# EAGLE schematic untitled (EAGLE 9.2.0)
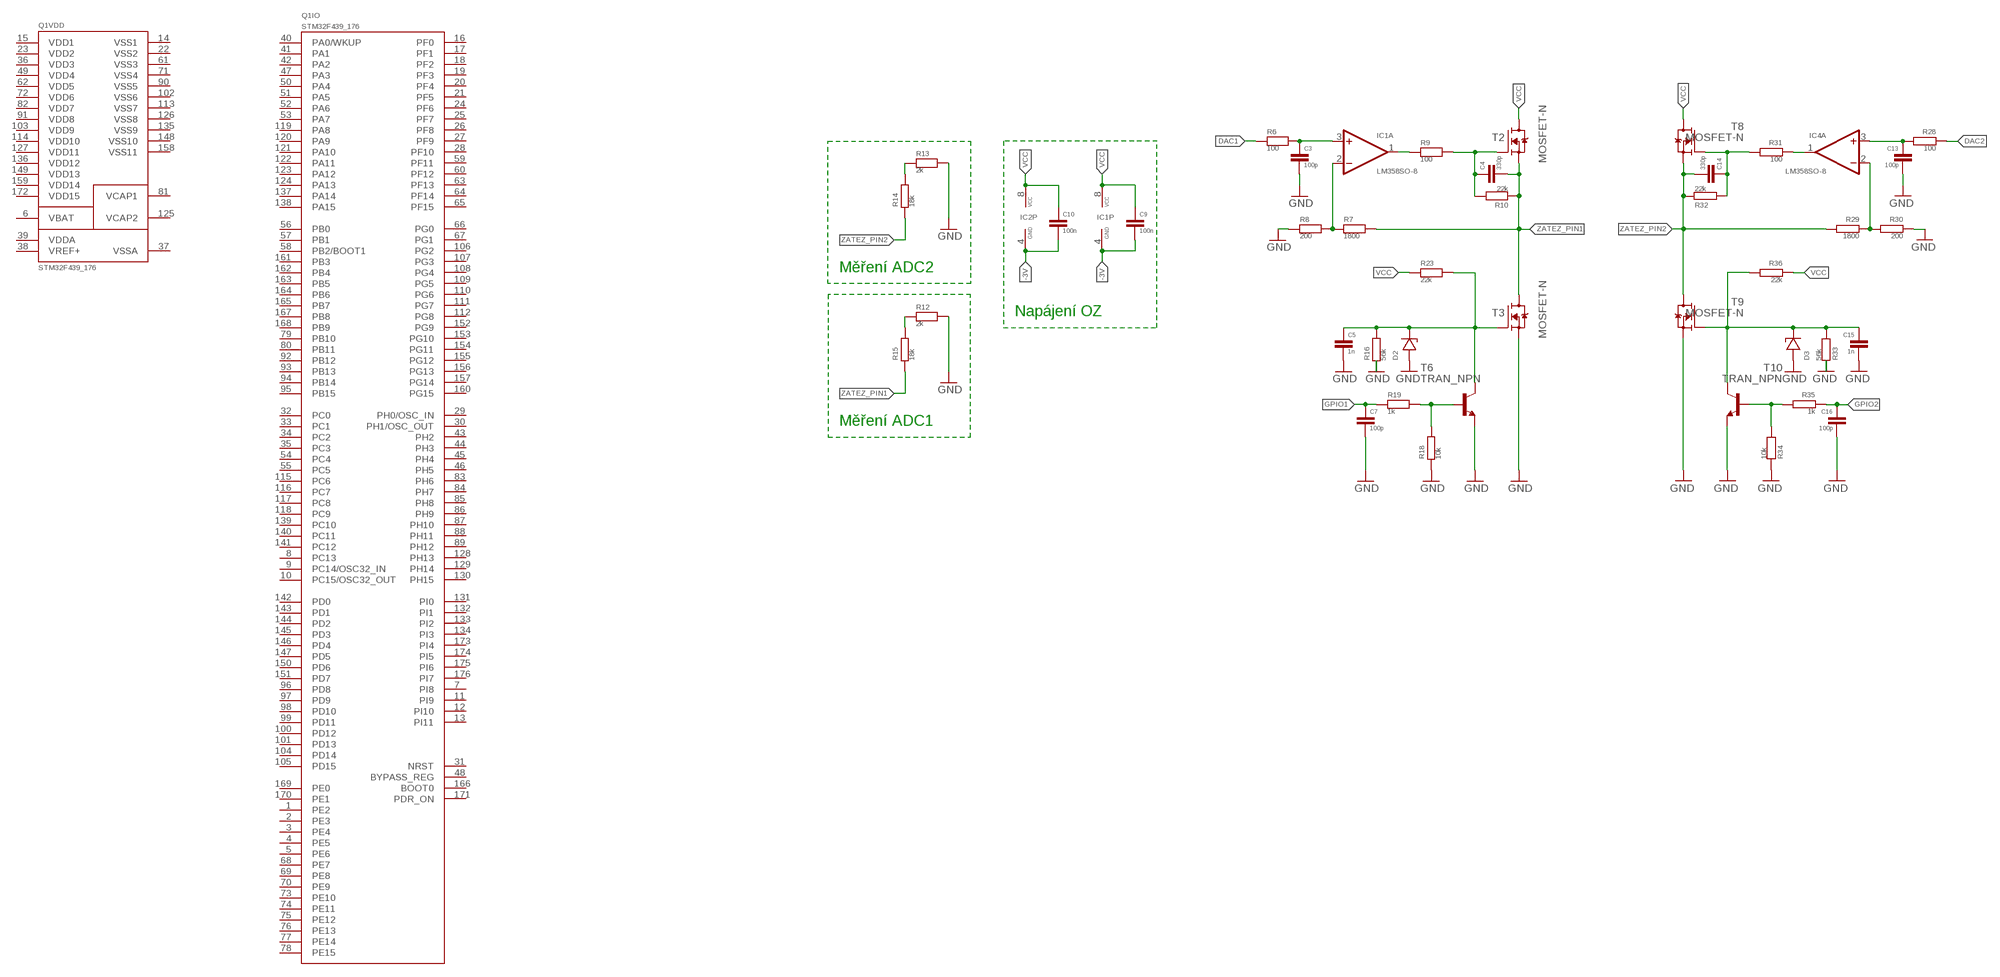
[diagram p0: schematic, sheet 1]

## Parts
C3  100p  C0603  [0603]
C4  330p  C0603  [0603]
C5  1n  C0603  [0603]
C7  100p  C0603  [0603]
C9  100n  C0603  [0603]
C10  100n  C0603  [0603]
C13  100p  C0603  [0603]
C14  330p  C0603  [0603]
C15  1n  C0603  [0603]
C16  100p  C0603  [0603]
D2  D_ZENERSMA  [SMA]
D3  D_ZENERSMA  [SMA]
IC1  LM358SO-8  [SO-8]
IC2  LM358SO-8  [SO-8]
IC4  LM358SO-8  [SO-8]
Q1  STM32F439_176  [TQFP176]
R6  100  R0603  [0603]
R7  1800  R0603  [0603]
R8  200  R0603  [0603]
R9  100  R0603  [0603]
R10  22k  R0603  [0603]
R12  2k  R0603  [0603]
R13  2k  R0603  [0603]
R14  18k  R0603  [0603]
R15  18k  R0603  [0603]
R16  56k  R0603  [0603]
R18  10k  R0603  [0603]
R19  1k  R0603  [0603]
R23  22k  R0603  [0603]
R28  100  R0603  [0603]
R29  1800  R0603  [0603]
R30  200  R0603  [0603]
R31  100  R0603  [0603]
R32  22k  R0603  [0603]
R33  56k  R0603  [0603]
R34  10k  R0603  [0603]
R35  1k  R0603  [0603]
R36  22k  R0603  [0603]
T2  MOSFET-N  MOSFET-NTO220DL  [TO220DL]
T3  MOSFET-N  MOSFET-NTO220DL  [TO220DL]
T6  TRAN_NPN  [SOT23-3]
T8  MOSFET-N  MOSFET-NTO220DL  [TO220DL]
T9  MOSFET-N  MOSFET-NTO220DL  [TO220DL]
T10  TRAN_NPN  [SOT23-3]

## Nets
-3V: C9.2 C10.2 IC1.4(P:GND) IC2.4(P:GND)
DAC1: R6.1
DAC2: R28.1
GND: C3.2 C5.2 C7.2 C13.2 C15.2 C16.2 D2.A D3.A R8.1 R12.2 R13.2 R16.1 R18.1 R30.1 R33.1 R34.1 T3.3(S) T6.2(E) T9.3(S) T10.2(E)
GPIO1: C7.1 R19.1
GPIO2: C16.1 R35.1
N$3: C3.1 IC1.3(A:+IN) R6.2
N$8: IC1.1(A:OUT) R9.1
N$9: C4.1 R9.2 R10.2 T2.1(G)
N$10: C13.1 IC4.3(A:+IN) R28.2
N$11: IC4.1(A:OUT) R31.1
N$12: R12.1 R15.2
N$13: R13.1 R14.2
N$14: IC1.2(A:-IN) R7.1 R8.2
N$16: C5.1 D2.C(K) R16.2 R23.2 T3.1(G) T6.3(C)
N$18: R18.2 R19.2 T6.1(B)
N$22: C15.1 D3.C(K) R33.2 R36.2 T9.1(G) T10.3(C)
N$23: R34.2 R35.2 T10.1(B)
N$24: C14.1 R31.2 R32.2 T8.1(G)
N$25: IC4.2(A:-IN) R29.1 R30.2
VCC: C9.1 C10.1 IC1.8(P:VCC) IC2.8(P:VCC) R23.1 R36.1 T2.2(D) T8.2(D)
ZATEZ_PIN1: C4.2 R7.2 R10.1 R15.1 T2.3(S) T3.2(D)
ZATEZ_PIN2: C14.2 R14.1 R29.2 R32.1 T8.3(S) T9.2(D)
Unconnected: IC1.5(B:+IN) IC1.6(B:-IN) IC1.7(B:OUT) IC2.1(A:OUT) IC2.2(A:-IN) IC2.3(A:+IN) IC2.5(B:+IN) IC2.6(B:-IN) IC2.7(B:OUT) IC4.5(B:+IN) IC4.6(B:-IN) IC4.7(B:OUT) Q1.1(IO:PE2) Q1.2(IO:PE3) Q1.3(IO:PE4) Q1.4(IO:PE5) Q1.5(IO:PE6) Q1.7(IO:PI8) Q1.8(IO:PC13) Q1.9(IO:PC14/OSC32_IN) Q1.10(IO:PC15/OSC32_OUT) Q1.11(IO:PI9) Q1.12(IO:PI10) Q1.13(IO:PI11) Q1.16(IO:PF0) Q1.17(IO:PF1) Q1.18(IO:PF2) Q1.19(IO:PF3) Q1.20(IO:PF4) Q1.21(IO:PF5) Q1.24(IO:PF6) Q1.25(IO:PF7) Q1.26(IO:PF8) Q1.27(IO:PF9) Q1.28(IO:PF10) Q1.29(IO:PH0/OSC_IN) Q1.30(IO:PH1/OSC_OUT) Q1.31(IO:NRST) Q1.32(IO:PC0) Q1.33(IO:PC1) Q1.34(IO:PC2) Q1.35(IO:PC3) Q1.38(VDD:VREF+) Q1.40(IO:PA0/WKUP) Q1.41(IO:PA1) Q1.42(IO:PA2) Q1.43(IO:PH2) Q1.44(IO:PH3) Q1.45(IO:PH4) Q1.46(IO:PH5) Q1.47(IO:PA3) Q1.48(IO:BYPASS_REG) Q1.50(IO:PA4) Q1.51(IO:PA5) Q1.52(IO:PA6) Q1.53(IO:PA7) Q1.54(IO:PC4) Q1.55(IO:PC5) Q1.56(IO:PB0) Q1.57(IO:PB1) Q1.58(IO:PB2/BOOT1) Q1.59(IO:PF11) Q1.60(IO:PF12) Q1.63(IO:PF13) Q1.64(IO:PF14) Q1.65(IO:PF15) Q1.66(IO:PG0) Q1.67(IO:PG1) Q1.68(IO:PE7) Q1.69(IO:PE8) Q1.70(IO:PE9) Q1.73(IO:PE10) Q1.74(IO:PE11) Q1.75(IO:PE12) Q1.76(IO:PE13) Q1.77(IO:PE14) Q1.78(IO:PE15) Q1.79(IO:PB10) Q1.80(IO:PB11) Q1.81(VDD:VCAP1) Q1.83(IO:PH6) Q1.84(IO:PH7) Q1.85(IO:PH8) Q1.86(IO:PH9) Q1.87(IO:PH10) Q1.88(IO:PH11) Q1.89(IO:PH12) Q1.92(IO:PB12) Q1.93(IO:PB13) Q1.94(IO:PB14) Q1.95(IO:PB15) Q1.96(IO:PD8) Q1.97(IO:PD9) Q1.98(IO:PD10) Q1.99(IO:PD11) Q1.100(IO:PD12) Q1.101(IO:PD13) Q1.104(IO:PD14) Q1.105(IO:PD15) Q1.106(IO:PG2) Q1.107(IO:PG3) Q1.108(IO:PG4) Q1.109(IO:PG5) Q1.110(IO:PG6) Q1.111(IO:PG7) Q1.112(IO:PG8) Q1.115(IO:PC6) Q1.116(IO:PC7) Q1.117(IO:PC8) Q1.118(IO:PC9) Q1.119(IO:PA8) Q1.120(IO:PA9) Q1.121(IO:PA10) Q1.122(IO:PA11) Q1.123(IO:PA12) Q1.124(IO:PA13) Q1.125(VDD:VCAP2) Q1.128(IO:PH13) Q1.129(IO:PH14) Q1.130(IO:PH15) Q1.131(IO:PI0) Q1.132(IO:PI1) Q1.133(IO:PI2) Q1.134(IO:PI3) Q1.137(IO:PA14) Q1.138(IO:PA15) Q1.139(IO:PC10) Q1.140(IO:PC11) Q1.141(IO:PC12) Q1.142(IO:PD0) Q1.143(IO:PD1) Q1.144(IO:PD2) Q1.145(IO:PD3) Q1.146(IO:PD4) Q1.147(IO:PD5) Q1.150(IO:PD6) Q1.151(IO:PD7) Q1.152(IO:PG9) Q1.153(IO:PG10) Q1.154(IO:PG11) Q1.155(IO:PG12) Q1.156(IO:PG13) Q1.157(IO:PG14) Q1.160(IO:PG15) Q1.161(IO:PB3) Q1.162(IO:PB4) Q1.163(IO:PB5) Q1.164(IO:PB6) Q1.165(IO:PB7) Q1.166(IO:BOOT0) Q1.167(IO:PB8) Q1.168(IO:PB9) Q1.169(IO:PE0) Q1.170(IO:PE1) Q1.171(IO:PDR_ON) Q1.173(IO:PI4) Q1.174(IO:PI5) Q1.175(IO:PI6) Q1.176(IO:PI7)

## Notes on the sheet
- Měření ADC2
- Napájení OZ
- Měření ADC1

## Power pins joined to a net without a drawn wire
GND: IC4.4(P:GND)
VBAT: Q1.6(VDD:VBAT)
VCC: IC4.8(P:VCC)
VDD1: Q1.15(VDD:VDD1)
VDD2: Q1.23(VDD:VDD2)
VDD3: Q1.36(VDD:VDD3)
VDD4: Q1.49(VDD:VDD4)
VDD5: Q1.62(VDD:VDD5)
VDD6: Q1.72(VDD:VDD6)
VDD7: Q1.82(VDD:VDD7)
VDD8: Q1.91(VDD:VDD8)
VDD9: Q1.103(VDD:VDD9)
VDD10: Q1.114(VDD:VDD10)
VDD11: Q1.127(VDD:VDD11)
VDD12: Q1.136(VDD:VDD12)
VDD13: Q1.149(VDD:VDD13)
VDD14: Q1.159(VDD:VDD14)
VDD15: Q1.172(VDD:VDD15)
VDDA: Q1.39(VDD:VDDA)
VSS1: Q1.14(VDD:VSS1)
VSS2: Q1.22(VDD:VSS2)
VSS3: Q1.61(VDD:VSS3)
VSS4: Q1.71(VDD:VSS4)
VSS5: Q1.90(VDD:VSS5)
VSS6: Q1.102(VDD:VSS6)
VSS7: Q1.113(VDD:VSS7)
VSS8: Q1.126(VDD:VSS8)
VSS9: Q1.135(VDD:VSS9)
VSS10: Q1.148(VDD:VSS10)
VSS11: Q1.158(VDD:VSS11)
VSSA: Q1.37(VDD:VSSA)

## Library data of the parts
C3-C5 C7 C9 C10 C13-C16 = ogr_lib:C: SMD/THD Ceramic or Foil Capacitor; DESCRIPTION: Capacitor Ceramic multilayer 50V X7R/X5R 10%; OC: Open Source; PRICE100: 0.2
D2 D3 = ogr_lib:D_ZENER: Zener Diode
IC1 IC2 IC4 = ogr_lib:LM358: IC, OP AMP
Q1 = ogr_lib:STM32F439_176: STMICROELECTRONICS STM32F439IIT6 MCU, 32BIT, CORTEX-M4, 180MHZ, LQFP-176; DESCRIPTION: STMICROELECTRONICS STM32F439IIT6 MCU, 32BIT, CORTEX-M4, 180MHZ, LQFP-176; OC: S:182443; PRICE100: 289
R6-R10 R12-R16 R18 R19 R23 R28-R36 = ogr_lib:R: Resistor; DESCRIPTION: SMD Chip Resistor Standart 1% 0.1W; OC: Open Source; PRICE100: 0.1
T2 T3 T8 T9 = ogr_lib:MOSFET-N: N-CHANNEL MOSFET GENERAL
T6 T10 = ogr_lib:TRAN_NPN: Bipolar Transistor, NPN